# Altium schematic sheet RADG-GPSRF-S02-V00.SchDoc: RADG GPS Module RF (Powered Antenna, Det, Short Det, Shield)
size A3; DrawnBy: Jonn Dillon; DocumentNumber: 2; SheetNumber: 4; SheetTotal: 6; Version: 00; Project: QUTMS RADIO GPS; PageSetup: Record=PageOptions|CenterHorizontal=True|CenterVertical=True|PrintScale=0.97|XCorrection=1.00|YCorrection=1.00|PrintKind=0|BorderSize=5000000|LeftOffset=0|BottomOffset=0|Orientation=2|PaperLength=1000|PaperWidth=1000|Scale=100|PaperSource=7|PrintQuality=-4|MediaType=1|DitherType=10|PaperKind=A4|PrintScaleMode=1
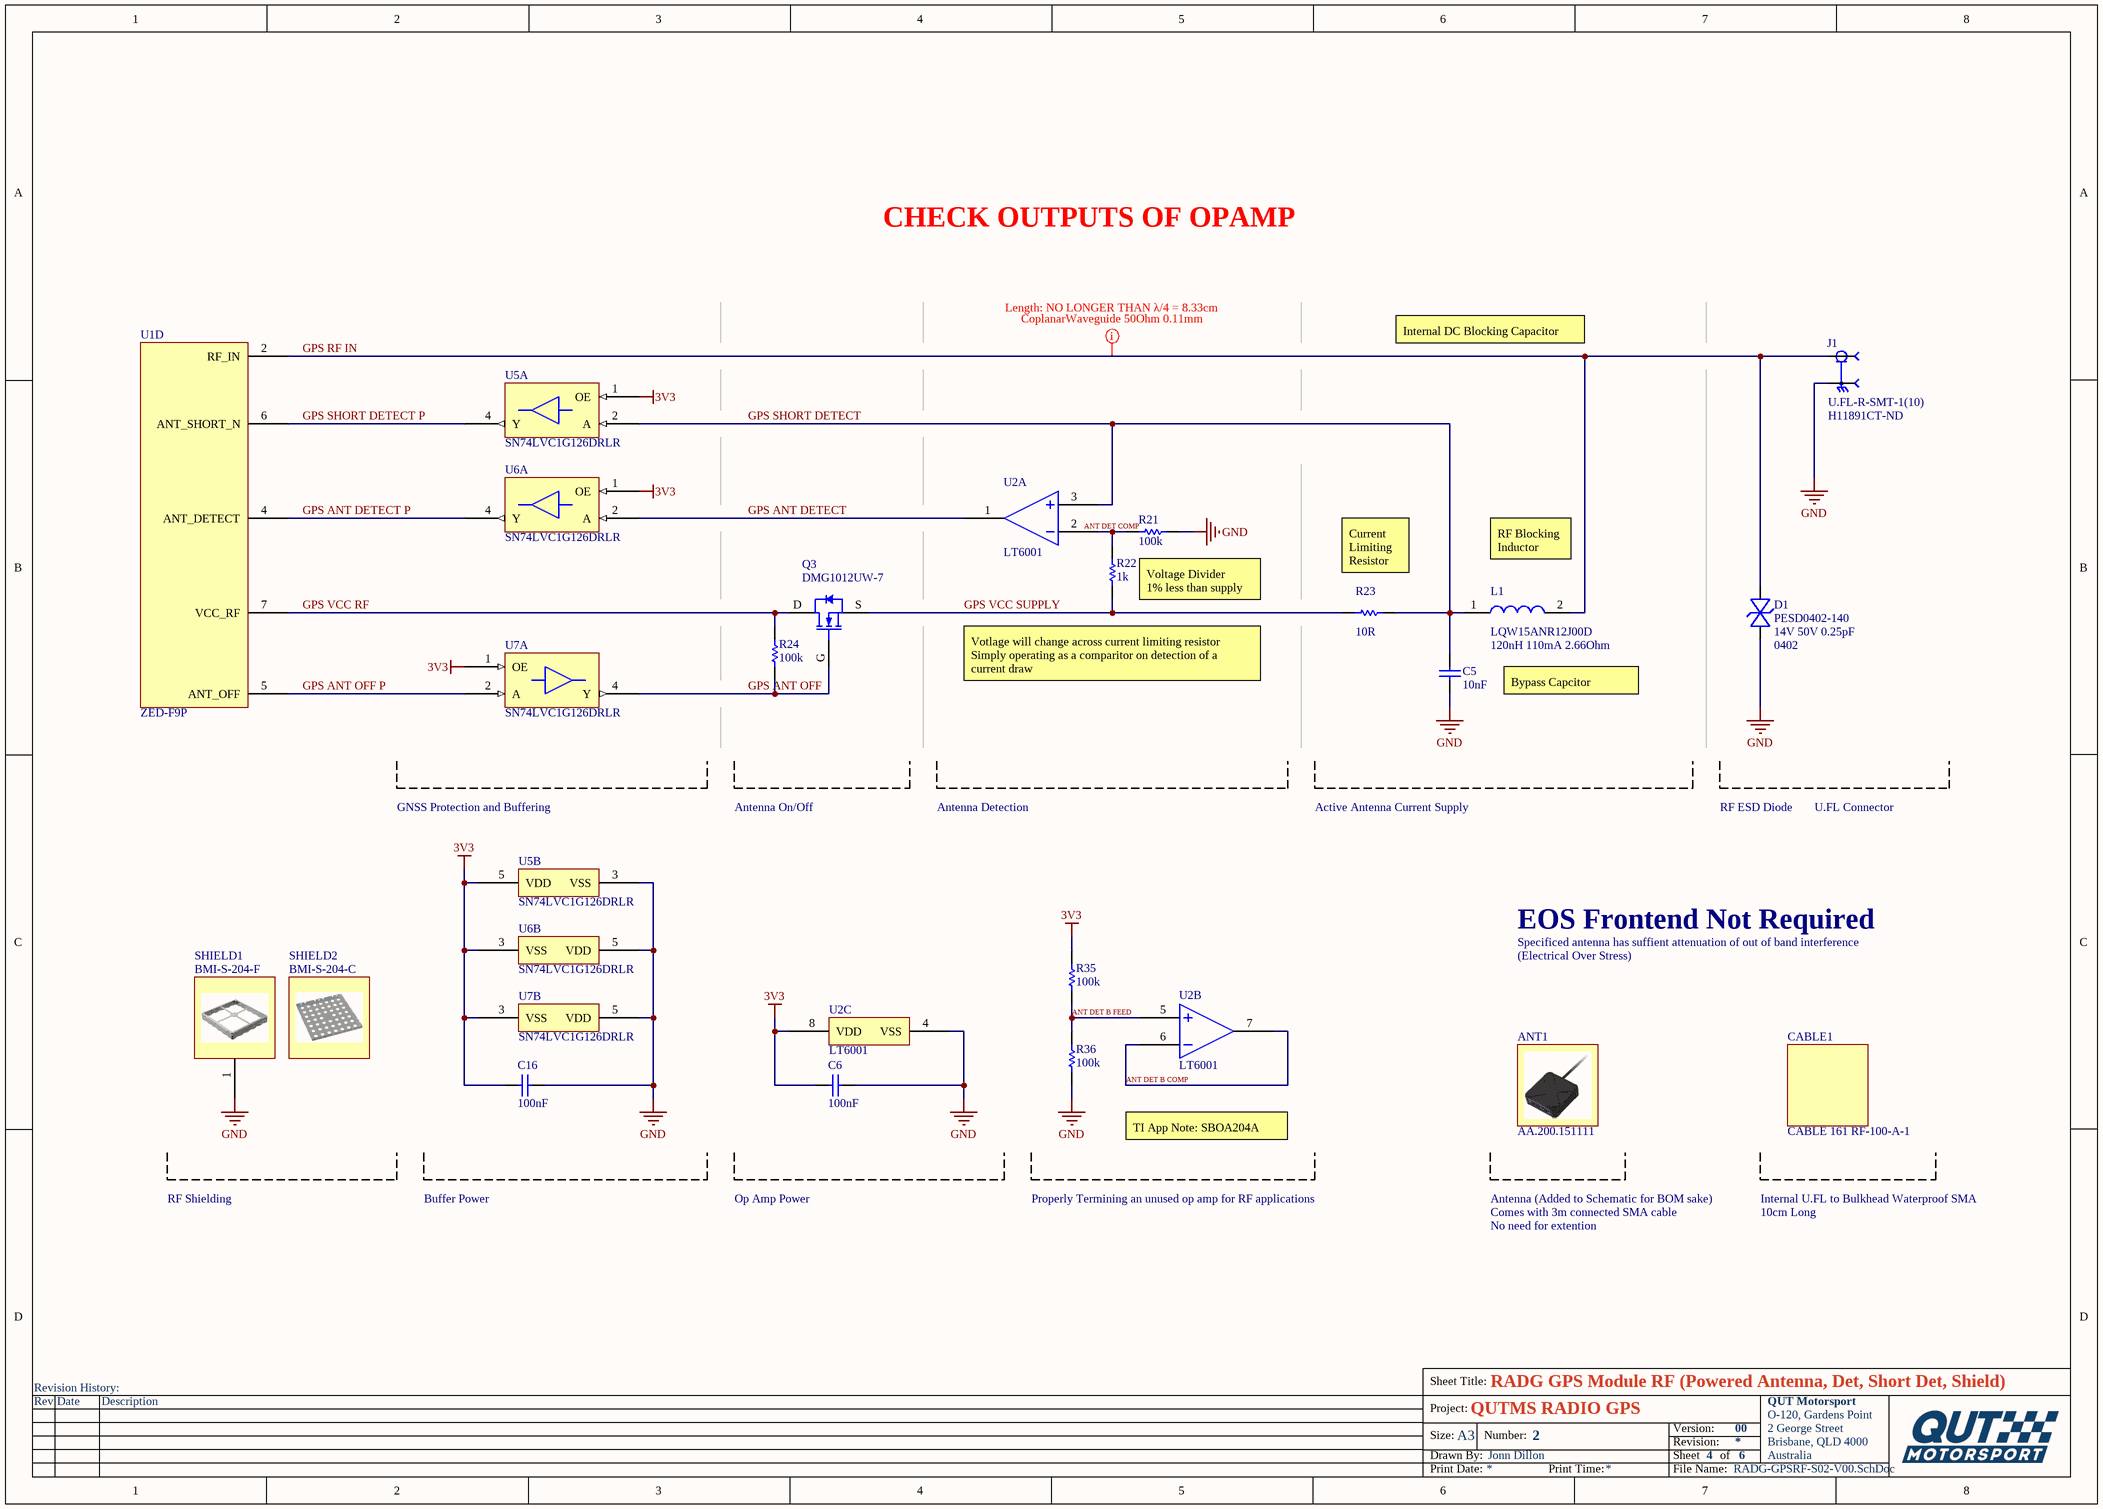
[diagram p0: RADG-GPSRF-S02-V00.SchDoc]

## Parts
ANT1  AA.200.151111
C5  10nF  [Cap_Ceramic_0603]
C6  100nF  [Cap_Ceramic_0603]
C16  100nF  [Cap_Ceramic_0603]
CABLE1  CABLE 161 RF-100-A-1
D1  PESD0402-140  [FERRITEBEAD_0402]
J1  U.FL-R-SMT-1(10)  [U.FL-R-SMT HIROSE]
L1  LQW15ANR12J00D  [FERRITEBEAD_0402]
Q3  DMG1012UW-7  [SC-70]
R21  100k  [Res_ThinFilm_0603]
R22  1k  [Res_ThinFilm_0603]
R23  10R  [Res_ThinFilm_0603]
R24  100k  [Res_ThinFilm_0603]
R35  100k  [Res_ThinFilm_0603]
R36  100k  [Res_ThinFilm_0603]
SHIELD1  BMI-S-204-F  [BMI-S-204-F]
SHIELD2  BMI-S-204-C
U1  ZED-F9P  [uBlox_ZED-F9P]  (part D of 4)
U2  LT6001  [MSOP-8]  (parts A,B,C of 3)
U5  SN74LVC1G126DRLR  [SOT-553]  (parts A,B of 2)
U6  SN74LVC1G126DRLR  [SOT-553]  (parts A,B of 2)
U7  SN74LVC1G126DRLR  [SOT-553]  (parts A,B of 2)

## Nets
3V3: C6.1 C16.1 R35.1 U2.8(VDD) U5.1(OE) U5.5(VDD) U6.1(OE) U6.3(VSS) U7.1(OE) U7.3(VSS)
GND: C5.1 C6.2 C16.2 D1.1(Anode) J1.2(GND) R21.1 R36.2 SHIELD1.1 U2.4(VSS) U5.3(VSS) U6.5(VDD) U7.5(VDD)
ANT DET B COMP: U2.6(IN2-) U2.7(OUT1)
ANT DET B FEED: R35.2 R36.1 U2.5(IN2+)
ANT DET COMP: R21.2 R22.2 U2.2(IN1-)
GPS ANT DETECT: U2.1(OUT1) U6.2(A)
GPS ANT DETECT P: U1.4(ANT_DETECT) U6.4(Y)
GPS ANT OFF: Q3.G R24.1 U7.4(Y)
GPS ANT OFF P: U1.5(ANT_OFF) U7.2(A)
GPS RF IN: D1.2(Cathode) J1.1(SIG) L1.2 U1.2(RF_IN)
GPS SHORT DETECT: C5.2 L1.1 R23.2 U2.3(IN1+) U5.2(A)
GPS SHORT DETECT P: U1.6(ANT_SHORT_N) U5.4(Y)
GPS VCC RF: Q3.D R24.2 U1.7(VCC_RF)
GPS VCC SUPPLY: Q3.S R22.1 R23.1

## Layout directives
rule Width Constraint [Pref Width = 9mil    Min Width = 9mil    Max Width = 9mil]; rule Impedance Constraint [Min = 49.50    Max = 50.50    ]; rule Clearance Constraint [Clearance = 14.5mil]: GPS RF IN

## Notes on the sheet
- CHECK OUTPUTS OF OPAMP
- Length: NO LONGER THAN λ/4 = 8.33cm
- Internal DC Blocking Capacitor
- (near J1) H11891CT-ND
- (near R23) Current Limiting Resistor
- RF Blocking Inductor
- Voltage Divider
  1% less than supply
- 120nH 110mA 2.66Ohm
- (near D1) 14V 50V 0.25pF
- (near D1) 0402
- (near R22) Votlage will change across current limiting resistor
  Simply operating as a comparitor on detection of a current draw
- Bypass Capcitor
- GNSS Protection and Buffering
- Antenna On/Off
- Antenna Detection
- Active Antenna Current Supply
- RF ESD Diode
- U.FL Connector
- Specificed antenna has suffient attenuation of out of band interference
- EOS Frontend Not Required
- (Electrical Over Stress)
- TI App Note: SBOA204A
- RF Shielding
- Buffer Power
- Op Amp Power
- Properly Termining an unused op amp for RF applications
- Antenna (Added to Schematic for BOM sake)
- Comes with 3m connected SMA cable
- No need for extention
- Internal U.FL to Bulkhead Waterproof SMA
- 10cm Long
- Revision History:
- Sheet Title:
- Rev
- Date
- Description
- Project:
- Size:
- Drawn By:
- A3
- Number:
- Revision:
- Sheet
- Version:
- of
- QUT Motorsport
- O-120, Gardens Point
- 2 George Street
- Brisbane, QLD 4000
- Australia
- Print Date:
- Print Time:
- File Name:

## Library data of the parts
ANT1 = AA.200.151111: Antennas GNSS L1/L2/L5 External 1500mm RG-174 SMA(M) ST
C5 = 10nF 50V 5% X7R 0603: Capacitor, Ceramic, SMD, 10nF, 50V, 5%, X7R, 0603
C6 C16 = 100nF 50V 5% X7R 0603: Capacitor, Ceramic, SMD, 100nF, 50V, 5%, X7R, 0603
CABLE1 = CABLE 161 RF-100-A-1: Cable Assembly Coaxial U.FL (UMCC), IPEX MHF1 to SMA Female to Female RG-178 3.937" (100.00mm)
D1 = PESD0402-140: 40V Clamp Ipp Tvs Diode Surface Mount 0402
J1 = U.FL-R-SMT-1(10): U.FL (UMCC) Connector Receptacle, Male Pin 50Ohm Surface Mount Solder,  H11891CT-ND
L1 = LQW15ANR12J00D: 120nH Unshielded Wirewound Inductor 110mA 2.66Ohm Max 0402 (1005 Metric)
Q3 = DMG1012UW-7: N-Channel 20V 1A (Ta) 290mW (Ta) Surface Mount SOT-323
R21 R24 R35 R36 = 100k 5%, 0603: Resistor, SMD, 100k, 0.1W, 5%, 0603
R22 = 1k 5% 0603: Resistor, SMD, 1k, 0.1W, 5%, 0603
R23 = 10R 5% 0603: Resistor, SMD, 10R, 0.1W, 5%, 0603
SHIELD1 = BMI-S-204-F: RF Shield Frame 1.260" (32.00mm) X 1.260" (32.00mm) Solder
SHIELD2 = BMI-S-204-C: RF Shield Cover 1.344" (34.14mm) X 1.468" (37.29mm) Vent Holes in Pattern Snap Fit
U2 = LT6001: General Purpose Amplifier 2 Circuit Rail-to-Rail 8-MSOP
U5-U7 = SN74LVC1G126DRLR: Buffer, Non-Inverting 1 Element 1 Bit per Element 3-State Output SOT-5